# EAGLE design RobotRaceB (EAGLE 7.7.0)
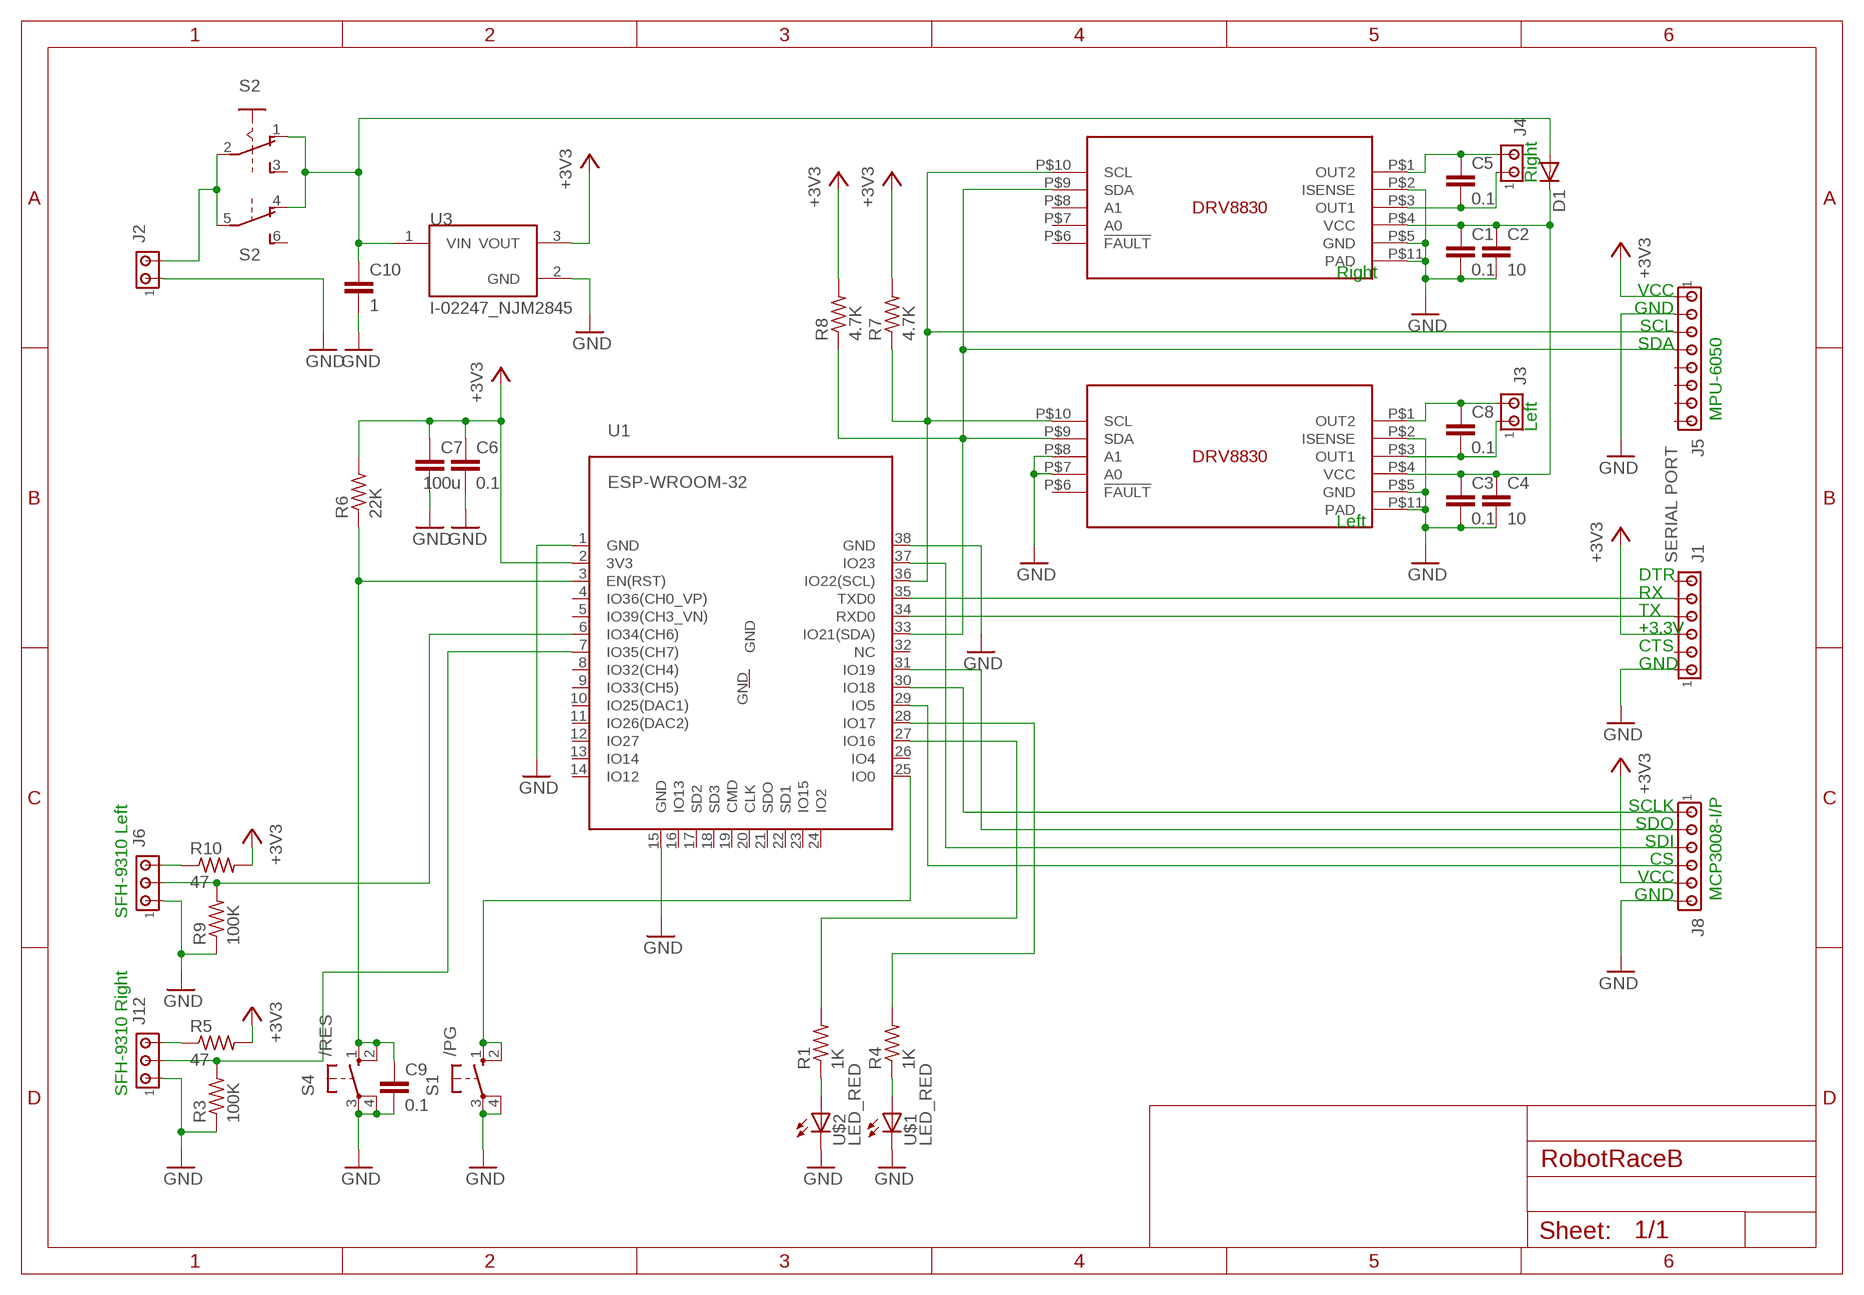
[diagram p0: schematic, sheet 1]

## Parts
C1  0.1  C  [C0805]
C2  10  C  [C0805]
C3  0.1  C  [C0805]
C4  10  C  [C0805]
C5  0.1  C  [C0805]
C6  0.1  C  [C0805]
C7  100u  C  [C0805]
C8  0.1  C  [C0805]
C9  0.1  C  [C0805]
C10  1  C  [C0805]
D1  DIODE-D-10  [D-10]
J1  SERIAL PORT  MTA06-100  [10X06MTA]
J2  MTA02-100  [10X02MTA]
J3  MTA02-100  [10X02MTA]
J4  MTA02-100  [10X02MTA]
J5  MTA08-100  [10X08MTA]
J6  MTA03-100  [10X03MTA]
J8  MTA06-100  [10X06MTA]
J12  MTA03-100  [10X03MTA]
R1  1K  R-US_M0805  [M0805]
R3  100K  R-US_M0805  [M0805]
R4  1K  R-US_M0805  [M0805]
R5  47  R-US_M0805  [M0805]
R6  22K  R-US_M0805  [M0805]
R7  4.7K  R-US_R0805  [R0805]
R8  4.7K  R-US_R0805  [R0805]
R9  100K  R-US_M0805  [M0805]
R10  47  R-US_M0805  [M0805]
S1  /PG  SW_10-XX  [B3F-10XX]
S2  SLIDE_SW_6P  [A68-A31]
S4  /RES  SW_10-XX  [B3F-10XX]
U1  ESP-WROOM-32  [ESP-WROOM-32]
U3  I-02247_NJM2845  [TO252]
U$1  LED_RED  LED_LEAD  [LED_LEAD]
U$2  LED_RED  LED_LEAD  [LED_LEAD]
U$4  DRV8830  [DRV8830]
U$6  DRV8830  [DRV8830]

## Nets
+3V1 [VDD]: C10.1 D1.A S2.1(A:O) S2.4(B:O) U3.1(VIN)
+3V3 [VDD]: C6.1 C7.1 J1.3 J5.1 J8.5 R5.2 R6.2 R7.2 R8.2 R10.2 U1.2(3V3) U3.3(VOUT)
GND [GND]: C1.2 C2.2 C3.2 C4.2 C6.2 C7.2 C9.2 C10.2 J1.1 J2.1 J5.2 J6.1 J8.6 J12.1 R3.1 R9.1 S1.3(P) S1.4(P1) S4.3(P) S4.4(P1) U1.1(GND) U1.15(GND) U1.38(GND) U3.2(GND) U$1.K(C) U$2.K(C) U$4.P$2(ISENSE) U$4.P$5(GND) U$4.P$11(PAD) U$6.P$2(ISENSE) U$6.P$5(GND) U$6.P$7(A0) U$6.P$8(A1) U$6.P$11(PAD)
N$1: R4.1 U$1.A
N$2 [VBAT]: J2.2 S2.2(A:P) S2.5(B:P)
N$3: C8.1 J3.2 U$6.P$1(OUT2)
N$4: C8.2 J3.1 U$6.P$3(OUT1)
N$5: C5.2 J4.1 U$4.P$3(OUT1)
N$6: R1.1 U$2.A
N$7: C9.1 R6.1 S4.1(S) S4.2(S1) U1.3(EN(RST))
N$9: J8.1 U1.30(IO18)
N$10: J8.2 U1.31(IO19)
N$11: J5.3 R7.1 U1.36(IO22(SCL)) U$4.P$10(SCL) U$6.P$10(SCL)
N$12: J12.3 R5.1
N$13: J6.2 R9.2 U1.6(IO34(CH6))
N$14: C5.1 J4.2 U$4.P$1(OUT2)
N$19: R1.2 U1.27(IO16)
N$20: J1.5 U1.35(TXD0)
N$21: J5.4 R8.1 U1.33(IO21(SDA)) U$4.P$9(SDA) U$6.P$9(SDA)
N$22: J1.4 U1.34(RXD0)
N$23: R4.2 U1.28(IO17)
N$24: J8.3 U1.37(IO23)
N$25: J8.4 U1.29(IO5)
N$29: S1.1(S) S1.2(S1) U1.25(IO0)
N$30: J6.3 R10.1
N$31: J12.2 R3.2 U1.7(IO35(CH7))
N$32: C1.1 C2.1 C3.1 C4.1 D1.C U$4.P$4(VCC) U$6.P$4(VCC)
Unconnected: J1.2 J1.6 J5.5 J5.6 J5.7 J5.8 S2.3(A:S) S2.6(B:S) U1.4(IO36(CH0_VP)) U1.5(IO39(CH3_VN)) U1.8(IO32(CH4)) U1.9(IO33(CH5)) U1.10(IO25(DAC1)) U1.11(IO26(DAC2)) U1.12(IO27) U1.13(IO14) U1.14(IO12) U1.16(IO13) U1.17(SD2) U1.18(SD3) U1.19(CMD) U1.20(CLK) U1.21(SDO) U1.22(SD1) U1.23(IO15) U1.24(IO2) U1.26(IO4) U1.32(NC) U1.GND U$4.P$6(!FAULT) U$4.P$7(A0) U$4.P$8(A1) U$6.P$6(!FAULT)

## Notes on the sheet
- Right
- Right
- VCC
- GND
- SCL
- SDA
- MPU-6050
- Left
- Left
- DTR
- RX
- TX
- +3.3V
- CTS
- GND
- SCLK
- SDO
- SDI
- CS
- VCC
- GND | MCP3008-I/P
- SFH-9310 Left
- SFH-9310 Right

## Library data of the parts
C1-C10 = 0my_lbr:C: CAPACITOR, European symbol; SPICEMODEL: NONE; SPICEPREFIX: C
D1 = 0my_lbr:DIODE-: DIODE
J1 J8 = 0my_lbr:MTA06-100: AMP connector Connection corrected 2014-09-19
J2-J4 = 0my_lbr:MTA02-100: AMP connector
J5 = 0my_lbr:MTA08-100: AMP connector
J6 J12 = 0my_lbr:MTA03-100: AMP connector
R1 R3-R10 = 0my_lbr:R-US_: RESISTOR, American symbol
S1 S4 = 0my_lbr:SW_10-XX: OMRON SWITCH; MPN: B3F-1000; OC_FARNELL: 176432; OC_NEWARK: 36M3542
S2 = 0my_lbr:SLIDE_SW_6P: SLIDING SWITCH Siemens, distributor Buerklin, 11G766
U1 = 0my_lbr:ESP-WROOM-32
U3 = Akizuki:I-02247_NJM2845
U$1 U$2 = 0my_lbr:LED_LEAD
U$4 U$6 = 0my_lbr:DRV8830

## Net classes
1 GND: width 0.203 mm
2 Power: width 0.61 mm
3 VBAT: width 0.762 mm, clearance 0.381 mm
4 VDD: width 0.762 mm, clearance 0.381 mm

## Board
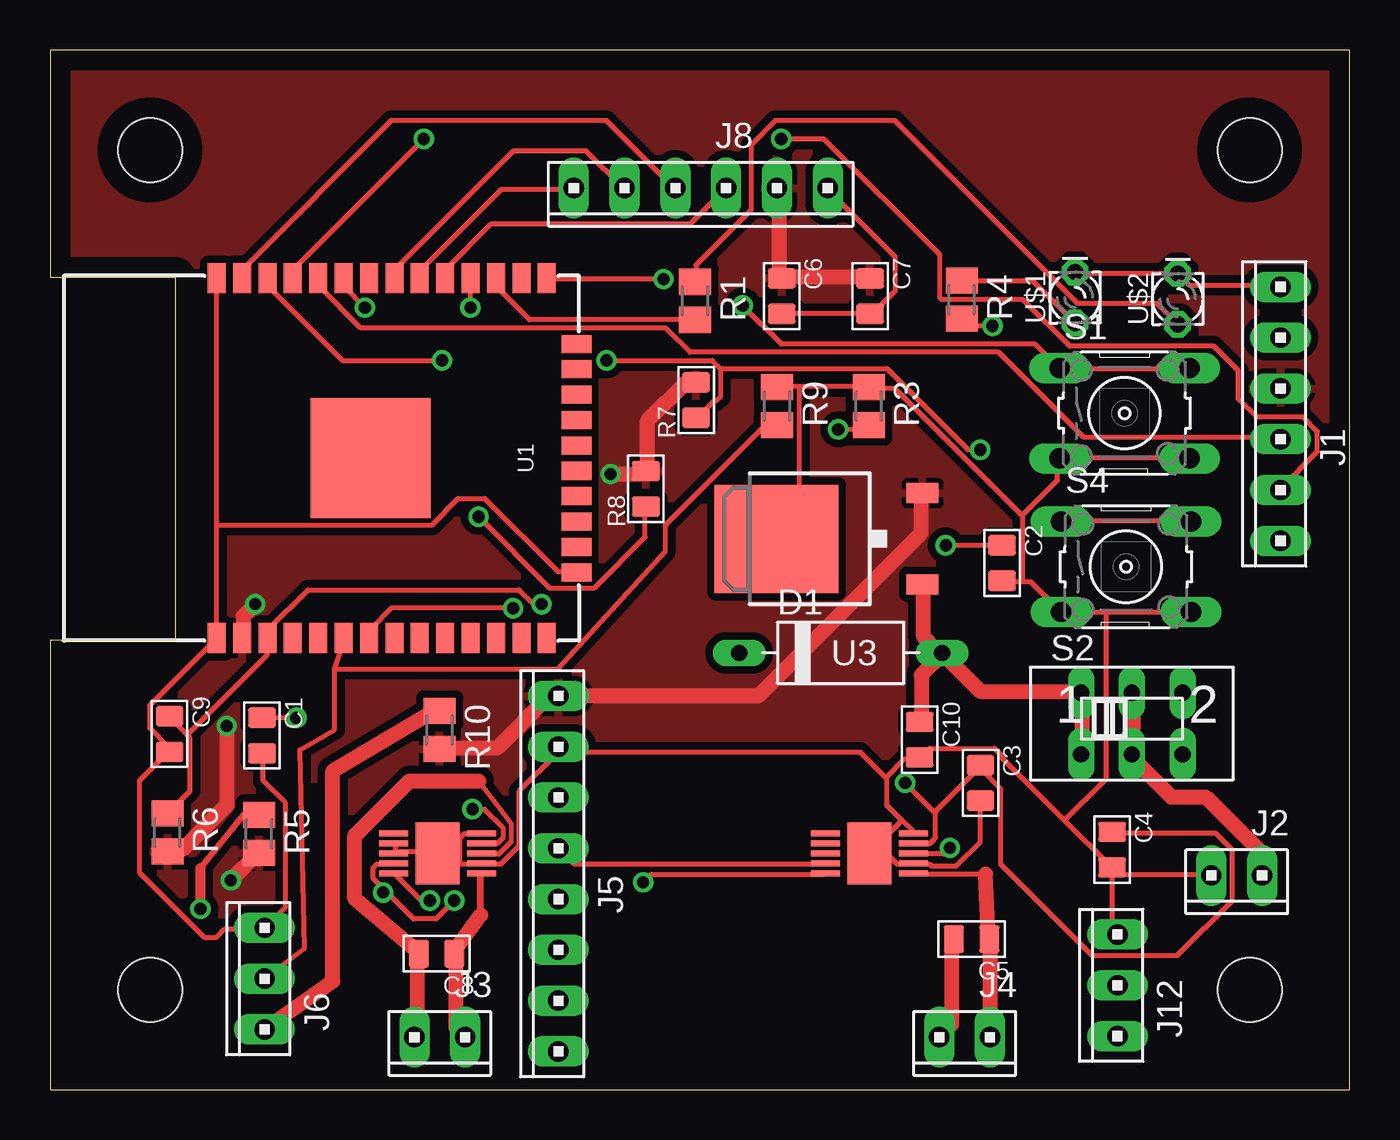
[diagram p1: board, top side]
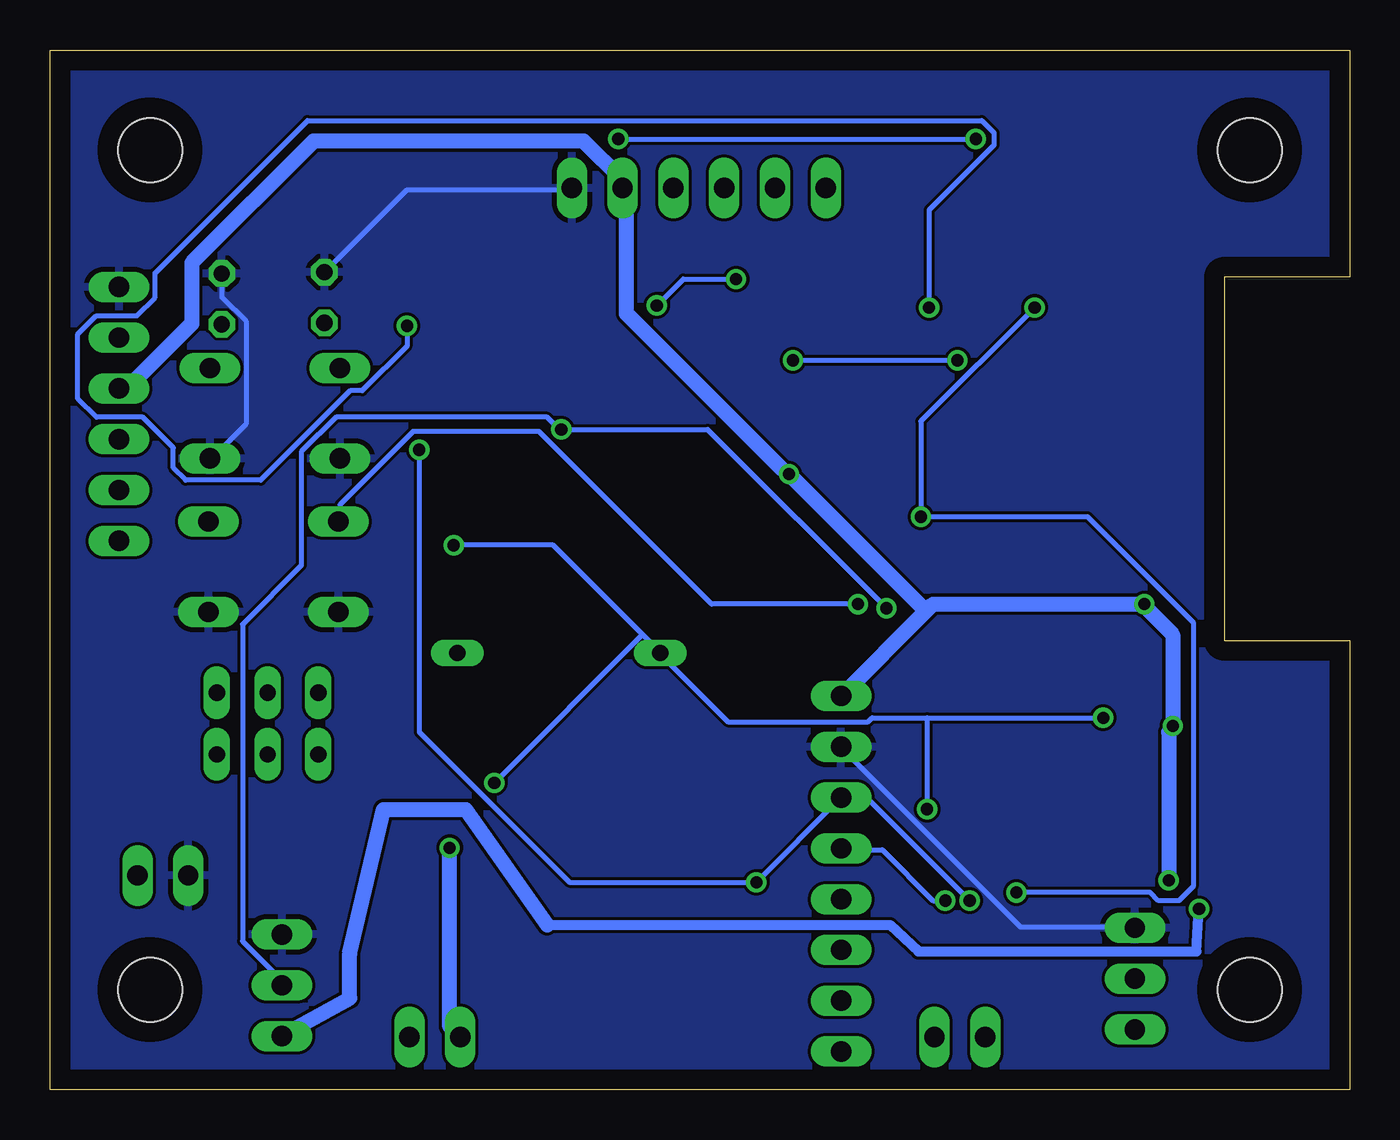
[diagram p2: board, bottom side, seen from below]

Size 65 x 52 mm. Coordinates in mm from the lower left corner, seen from the top.
Outline: 0,0 65,0 65,52 0,52 0,40.63 6.27,40.63 6.27,22.46 0,22.46 0,0
Copper layers (1*16): Top 0.035mm / dielectric 1.5mm / Bottom 0.035mm
Design rules "default *": minimum track width 10mil, minimum drill 24mil, track to track 6mil, track to pad 6mil, pad to pad 8mil, via to via 8mil, smd to smd 8mil, copper to edge 40mil, drill to drill 8mil, minimum pad ring 10mil, minimum via ring 8mil, stop-mask expansion 4mil, vias tented up to drill 0mil, thermal gap 10mil
Holes 3.2 mm at 60,47 60,5 5,5 5,47

### Footprints (pad centres in the part's own frame; a part is rotated, then mirrored left to right if it is on the bottom)
C0805 = smd 1.397 x 1.016: 1 0,0.889; 2 0,-0.889
D-10 = drill 0.813 long: A 5.08,0; C -5.08,0
10X06MTA = drill 1.016 long: 1 6.35,0; 2 3.81,0; 3 1.27,0; 4 -1.27,0; 5 -3.81,0; 6 -6.35,0
10X02MTA = drill 1.016 long: 1 1.27,0; 2 -1.27,0
10X08MTA = drill 1.016 long: 1 8.89,0; 2 6.35,0; 3 3.81,0; 4 1.27,0; 5 -1.27,0; 6 -3.81,0; 7 -6.35,0; 8 -8.89,0
10X03MTA = drill 1.016 long: 1 2.54,0; 2 0,0; 3 -2.54,0
M0805 = smd 1.3 x 1.6: 1 -0.95,0; 2 0.95,0
R0805 = smd 1.397 x 1.016: 1 0,0.889; 2 0,-0.889
B3F-10XX = drill 1.016 long: 1 -3.251,2.261; 2 3.251,2.261; 3 -3.251,-2.261; 4 3.251,-2.261
A68-A31 = drill 0.813 long: 1 -2.54,-2.54; 2 0,-2.54; 3 2.54,-2.54; 4 -2.54,0.54; 5 0,0.54; 6 2.54,0.54
ESP-WROOM-32 = smd 0.9 x 1.5: 1 7.7,9; 2 6.43,9; 3 5.16,9; 4 3.89,9; 5 2.62,9; 6 1.35,9; 7 0.08,9; 8 -1.19,9; 9 -2.46,9; 10 -3.73,9; 11 -5,9; 12 -6.27,9; 13 -7.54,9; 14 -8.81,9; 25 -8.81,-9; 26 -7.54,-9; 27 -6.27,-9; 28 -5,-9; 29 -3.73,-9; 30 -2.46,-9; 31 -1.19,-9; 32 0.08,-9; 33 1.35,-9; 34 2.62,-9; 35 3.89,-9; 36 5.16,-9; 37 6.43,-9; 38 7.7,-9 | smd 1.5 x 0.9: 15 -10.3,5.715; 16 -10.3,4.445; 17 -10.3,3.175; 18 -10.3,1.905; 19 -10.3,0.635; 20 -10.3,-0.635; 21 -10.3,-1.905; 22 -10.3,-3.175; 23 -10.3,-4.445; 24 -10.3,-5.715 | smd 6 x 6: GND 0,0
TO252 = smd 1 x 1.6: 1 -2.28,-4.8; 3 2.28,-4.8 | smd 5.4 x 6.2: 2 0,2.5
LED_LEAD = drill 0.813 octagon: A -1.27,0; K 1.27,0
DRV8830 = smd 1.45 x 0.3: P$1 -2.2,1; P$2 -2.2,0.5; P$3 -2.2,0; P$4 -2.2,-0.5; P$5 -2.2,-1; P$6 2.2,-1; P$7 2.2,-0.5; P$8 2.2,0; P$9 2.2,0.5; P$10 2.2,1 | smd 2.2 x 3.1: P$11 0,0

### Placement (x,y rotation side)
C1  10.61,17.7 0 top
C2  47.62,26.34 0 top
C3  46.54,15.34 0 top
C4  53.12,12 0 top
C5  46.1,7.53 270 top
C6  36.6,39.69 0 top
C7  41.02,39.69 0 top
C8  19.34,6.79 270 top
C9  5.99,17.78 0 top
C10  43.5,17.5 0 top
D1  39.55,21.84 0 top
J1  61.55,33.8 90 top
J2  59.35,10.71 180 top
J3  19.5,2.62 180 top
J4  45.75,2.62 180 top
J5  25.43,10.79 90 top
J6  10.73,5.54 90 top
J8  32.55,45.09 180 top
J12  53.4,5.21 90 top
R1  32.27,39.45 270 top
R3  40.95,34.18 270 top
R4  45.6,39.51 270 top
R5  10.46,12.78 270 top
R6  5.88,12.86 270 top
R7  32.31,34.48 180 top
R8  29.8,30.05 180 top
R9  36.37,34.18 270 top
R10  19.49,18 270 top
S1  53.74,33.83 0 top
S2  54.12,19.3 0 top
S4  53.82,26.15 0 top
U1  16.04,31.59 180 top
U3  38.84,27.55 90 top
U$1  51.27,39.62 90 top
U$2  56.41,39.55 90 top
U$4  40.99,11.8 180 top
U$6  19.39,11.8 180 top

### Tracks (layer width: path | path; a pad name or v marks a point on that pad's centre or on a via)
+3V1
  Top 0.762: S2.1 51.61,16.87 51.61,19.81 S2.4 51.21,19.91 46.53,19.91 44.91,21.54 D1.A | C10.1 43.59,18.39 43.59,20.73 44.6,21.74 D1.A | U3.1 43.69,25.2 43.69,22.66 44.3,22.05 D1.A
+3V3  (via drill 0.61)
  Top 0.762: C7.1 40.95,40.64 36.68,40.64 C6.1 36.47,40.95 36.47,44.91 36.37,45.01 J8.5 | R7.2 32.31,35.36 31.8,35.36 29.87,33.43 29.87,30.99 R8.2 29.46,30.79 v28.04,30.79 | v10.26,24.28 9.65,23.67 9.65,22.66 U1.2 | v8.84,18.19 8.84,14.22 6.6,11.99 5.89,11.99 R6.2 | v9.04,10.46 10.36,11.79 R5.2 | R10.2 19.51,17.07 22.35,17.07 24.89,19.61 25.4,19.61 J5.1 25.81,19.71 35.46,19.71 43.59,27.84 43.59,29.77 U3.3
  Bottom 0.762: J1.3 61.47,35.15 61.06,35.15 57.91,38.3 57.91,41.35 51.82,47.45 38.3,47.45 36.37,45.52 36.37,45.11 J8.5 36.17,44.81 36.17,38.81 28.35,30.99 v28.04,30.79 21.18,23.93 | 21.18,23.93 25.4,19.71 J5.1 | 21.18,23.93 20.83,24.28 v10.26,24.28 10.06,23.98 8.84,22.76 v8.84,18.19 9.04,17.88 v9.04,10.46
  pour Top (rank 2): -11,53 79,53 79,-1 -11,-1
GND
  Top 0.254: C1.2 10.67,16.76 10.67,15.44 11.79,14.33 11.79,9.14 10.77,8.13 J6.1 10.67,8.03 8.74,8.03 8.33,7.62 7.72,7.62 4.47,10.87 4.47,15.44 5.89,16.87 C9.2 5.89,16.97 5.89,17.17 4.98,18.09 4.98,19.2 8.33,22.55 U1.1 8.33,22.66 8.33,28.25 | 8.33,28.25 8.33,40.54 U1.38 | 8.33,28.25 19.1,28.25 20.42,29.57 21.74,29.57 25.4,25.91 26.31,25.91 U1.15 | C6.2 36.68,38.81 40.95,38.81 C7.2 41.15,38.81 42.27,39.93 42.27,41.66 38.91,45.01 J8.6 | U$1.K 51.31,40.84 56.39,40.84 U$2.K 56.49,40.74 57,40.23 61.47,40.23 J1.1 | 37.49,35.15 40.95,35.15 R3.1 41.05,35.05 42.27,35.05 48.56,28.75 48.67,28.75 | 37.49,35.15 36.37,35.15 R9.1 | 37.49,35.15 37.49,28.75 36.37,27.64 U3.2 | S1.4 56.9,31.6 50.49,31.6 S1.3 50.39,31.5 50.39,30.48 48.67,28.75 | 48.67,25.4 49.07,25.4 50.49,23.98 S4.3 50.6,23.88 52.83,23.88 | 48.67,25.4 47.65,25.4 C2.2 | 52.83,23.88 57,23.88 S4.4 | 48.67,25.4 48.67,28.75 | U$6.P$7 17.27,12.29 17.27,11.89 U$6.P$8 17.37,11.89 19.3,11.89 U$6.P$11 19.41,11.79 19.91,11.28 20.52,11.28 | 20.52,11.28 21.54,11.28 U$6.P$2 21.64,11.28 22.55,11.28 23.47,12.19 23.47,14.94 25.4,16.87 25.4,17.07 J5.2 25.5,16.87 40.54,16.87 41.76,15.65 41.86,15.65 | 20.52,11.28 20.52,12.6 20.73,12.8 21.54,12.8 U$6.P$5 | C4.2 53.14,11.07 53.14,8.03 53.34,7.82 J12.1 | J2.1 58.01,10.77 53.24,10.77 C4.2 | C3.2 46.53,14.43 46.53,12.39 45.31,11.18 44.09,11.18 43.99,11.28 43.28,11.28 U$4.P$2 43.08,11.28 42.37,11.28 41.45,12.19 U$4.P$11 41.05,11.89 42.62,13.46 | 41.86,15.65 42.77,16.56 43.48,16.56 C10.2 43.59,16.66 43.99,17.07 47.24,17.07 47.55,16.76 47.55,16.66 50.75,13.46 | 41.86,15.65 41.86,14.22 42.62,13.46
  Top 0.254: 42.62,13.46 43.18,12.9 U$4.P$5 | 50.75,13.46 53.03,11.18 C4.2 | 52.83,23.88 52.83,15.54 50.75,13.46
  Bottom 0.254: J8.6 38.91,45.01 47.14,45.01 51.21,40.95 U$1.K | U$2.K 56.39,40.74 56.39,39.62 55.17,38.41 55.17,33.33 56.9,31.6 S1.4 | J6.1 10.77,8.13 16.46,8.13 25.4,17.07 J5.2
  pour Bottom: -3.5,51.5 -3.5,-2.5 66.5,-2.5 66.5,51.5
N$1
  Top 0.254: R4.1 45.62,40.44 49.17,40.44 51.21,38.41 U$1.A
N$2
  Top 0.762: S2.5 54.15,19.81 54.15,16.87 S2.2 54.25,16.46 56.08,14.63 57.81,14.63 60.55,11.89 60.55,10.77 J2.2
N$3
  Top 0.254: 20.32,3.05 20.73,2.64 J3.2 | 20.32,6.71 C8.1 20.22,6.91 | 21.54,10.77 U$6.P$1
  Top 0.35: 21.54,8.73 21.54,10.77
  Top 0.762: 20.32,3.05 20.32,6.71 | 20.22,6.91 21.54,8.73
N$4
  Top 0.254: 18.39,2.74 18.29,2.64 J3.1 | 18.39,6.71 C8.2 18.39,6.91 | 21.44,15.44 23.06,13.31 23.06,12.39 22.45,11.79 21.64,11.79 U$6.P$3
  Top 0.762: 18.39,2.74 18.39,6.71 | 21.44,15.44 17.98,15.44 15.25,12.7 15.25,9.55 18.39,6.91
N$5  (via drill 0.61)
  Top 0.254: 45.11,3.25 44.5,2.64 J4.1 | 45.11,7.52 C5.2 | v45.01,12.09 44.7,11.79 43.28,11.79 U$4.P$3
  Top 0.762: 45.11,3.25 45.11,7.52
  Bottom 0.254: 45.01,3.15 44.5,2.64 J4.1
  Bottom 0.762: 45.01,3.15 v45.01,12.09
N$6
  Top 0.254: R1.1 32.31,40.44 32.31,41.25 35.05,43.99 35.05,47.24 36.27,48.46 42.27,48.46 51.41,39.32 55.37,39.32 56.39,38.3 U$2.A
N$7  (via drill 0.61)
  Top 0.254: S4.1 50.6,28.45 57,28.45 S4.2 | 6.86,17.73 7.01,17.58 7.01,14.94 5.89,13.82 R6.1 | 6.86,17.73 5.99,18.59 C9.1 | 6.86,17.73 10.87,21.74 10.87,22.55 U1.3 10.97,22.66 10.97,23.06 12.9,24.99 23.47,24.99 24.18,24.28 v24.59,24.28
  Bottom 0.254: v24.59,24.28 31.9,24.28 40.54,32.92 46.84,32.92 50.49,29.26 50.49,28.45 S4.1
N$9
  Top 0.254: U1.30 18.59,40.64 18.59,41.05 22.55,45.01 26.11,45.01 J8.1
N$10
  Top 0.254: U1.31 17.27,40.64 17.27,41.05 23.16,46.94 26.82,46.94 28.65,45.11 J8.2
N$11  (via drill 0.61)
  Top 0.254: v19,9.45 18.59,9.45 17.27,10.77 U$6.P$10 | v29.67,10.36 30.07,10.77 38.71,10.77 U$4.P$10 | 33.53,36.07 33.53,34.65 33.33,34.44 33.22,34.44 32.41,33.63 R7.1 | 33.53,36.07 33.12,36.47 v27.84,36.47 | v19.61,36.47 14.63,36.47 10.97,40.13 10.97,40.54 U1.36 | v46.53,32 45.92,32 41.86,36.07 33.53,36.07
  Bottom 0.254: v19,9.45 24.08,14.53 25.4,14.53 J5.3 25.5,14.53 v29.67,10.36 39.01,10.36 46.53,17.88 v46.53,32 | v19.61,36.47 v27.84,36.47
N$12  (via drill 0.61)
  Top 0.254: 9.66,13.72 10.36,13.72 R5.1
  Top 0.3: 7.53,11.08 9.66,13.72
  Top 0.5: v7.53,9.03 7.53,11.08
  Bottom 0.254: 53.34,2.74 J12.3
  Bottom 0.5: v7.53,9.03 7.65,6.91 21.56,6.91 22.99,8.23 40.13,8.23
  Bottom 0.762: 40.13,8.23 44.2,14.01 48.31,14.01 50.01,6.81 50.01,4.57 53.34,2.74
N$13
  Top 0.254: 14.23,21.04 14.23,18 12.5,17 12.73,7.05 10.77,5.59 J6.2 | 14.23,21.04 14.73,22.55 U1.6 | 14.23,21.04 25.4,21.04 30.79,26.92 30.79,28.25 35.76,33.22 36.27,33.22 R9.2
N$14
  Top 0.254: 47.04,7.52 C5.1 46.94,7.62 | 47.04,2.64 J4.2 | 46.79,10.77 43.28,10.77 U$4.P$1
  Top 0.762: 47.04,2.64 47.04,7.52 | 46.94,7.62 46.79,10.77
N$19
  Top 0.254: U1.27 22.35,40.54 22.35,40.13 23.98,38.51 32.21,38.51 R1.2
N$20  (via drill 0.61)
  Top 0.254: v18.69,47.55 12.19,41.05 12.19,40.64 U1.35 | v36.58,47.55 38.71,47.55 44.5,41.76 44.5,39.62 44.6,39.52 48.67,39.52 51,37.19 58.22,37.19 59.44,35.97 59.44,34.54 60.35,33.63 62.69,33.63 63.4,32.92 63.4,31.9 61.57,30.07 J1.5
  Bottom 0.254: v36.58,47.55 v18.69,47.55
N$21  (via drill 0.61)
  Top 0.254: 16.82,9.91 18.19,8.53 19.3,8.53 v20.22,9.45 | 16.82,9.91 16.15,10.57 16.15,11.07 16.36,11.28 17.17,11.28 U$6.P$9 | U$4.P$9 38.71,11.28 26.21,11.28 25.5,11.99 J5.4 | v21.44,28.65 24.99,25.09 27.23,25.09 29.77,27.64 29.77,29.16 R8.1 | v15.75,39.12 14.73,40.13 14.73,40.54 U1.33 | v16.66,9.86 16.76,9.86 16.82,9.91
  Bottom 0.254: v20.22,9.45 20.83,9.45 23.37,11.99 25.4,11.99 J5.4 | v15.75,39.12 21.44,33.43 v21.44,28.65 13.11,28.65 7.82,23.37 7.82,10.16 8.53,9.45 9.55,9.45 9.96,9.86 v16.66,9.86
N$22
  Top 0.254: U1.34 13.51,40.54 13.51,40.13 15.54,38.1 30.79,38.1 32,36.88 47.45,36.88 51.71,32.61 61.47,32.61 J1.4
N$23  (via drill 0.61)
  Top 0.254: v21.03,39.12 21.03,40.54 U1.28 | v47.14,38.2 45.92,38.2 45.62,38.51 R4.2
  Bottom 0.254: v21.03,39.12 21.03,43.99 17.78,47.24 17.78,47.85 18.39,48.46 52.12,48.46 59.74,40.84 59.74,39.62 60.66,38.71 62.69,38.71 63.6,37.8 63.6,34.54 62.69,33.63 60.35,33.63 58.83,32.11 58.83,31.09 58.22,30.48 54.46,30.48 49.99,34.95 49.38,34.95 47.14,37.19 v47.14,38.2
N$24
  Top 0.254: U1.37 9.65,40.64 9.65,41.05 17.07,48.46 27.84,48.46 31.19,45.11 J8.3
N$25
  Top 0.254: U1.29 19.81,40.64 19.81,41.05 22.05,43.28 32,43.28 33.73,45.01 J8.4
N$29  (via drill 0.61)
  Top 0.254: v30.68,40.54 24.89,40.54 U1.25 | v34.65,39.22 36.58,37.29 49.28,37.29 50.39,36.17 S1.1 50.6,36.07 56.9,36.07 S1.2
  Bottom 0.254: v30.68,40.54 33.33,40.54 v34.65,39.22
N$30
  Top 0.254: 19.1,18.9 19.41,18.9 R10.1 | 10.77,3.05 J6.3
  Top 0.762: 19.1,18.9 14.14,15.94 14.14,5.42 10.77,3.05
N$31  (via drill 0.61)
  Top 0.254: v23.16,24.08 17.07,24.08 16.05,23.06 16.05,22.66 U1.7 | v39.42,33.02 40.74,33.02 R3.2
  Bottom 0.254: v23.16,24.08 32.11,33.02 v39.42,33.02 39.52,33.02 40.13,33.63 50.7,33.63 52.43,31.9 52.43,26.21 55.37,23.27 55.37,7.42 53.44,5.49 53.44,5.28 J12.2
N$32  (via drill 0.61)
  Top 0.254: 44.3,13.92 46.53,16.15 C3.1 46.53,16.05 47.55,15.04 47.55,11.28 52.12,6.71 56.39,6.71 59.13,9.45 59.13,11.99 58.32,12.8 53.14,12.8 C4.1 | 44.3,13.92 44.3,12.6 43.99,12.29 43.28,12.29 U$4.P$4 | v12.32,18.59 10.67,18.59 C1.1 | v44.81,27.23 47.55,27.23 C2.1 | v21.13,14.02 21.74,14.02 22.66,13.11 22.66,12.6 22.35,12.29 21.64,12.29 U$6.P$4 | v42.77,15.34 44.2,13.92 44.3,13.92
  Bottom 0.254: 21.13,18.59 23.88,18.59 24.08,18.39 31.09,18.39 34.44,21.74 D1.C 34.54,21.95 35.36,22.76 | 21.13,18.59 v12.32,18.59 | v44.81,27.23 39.83,27.23 35.36,22.76 | 21.13,18.59 v21.13,14.02 | 35.36,22.76 v42.77,15.34